# Altium project host to host.PrjPcb
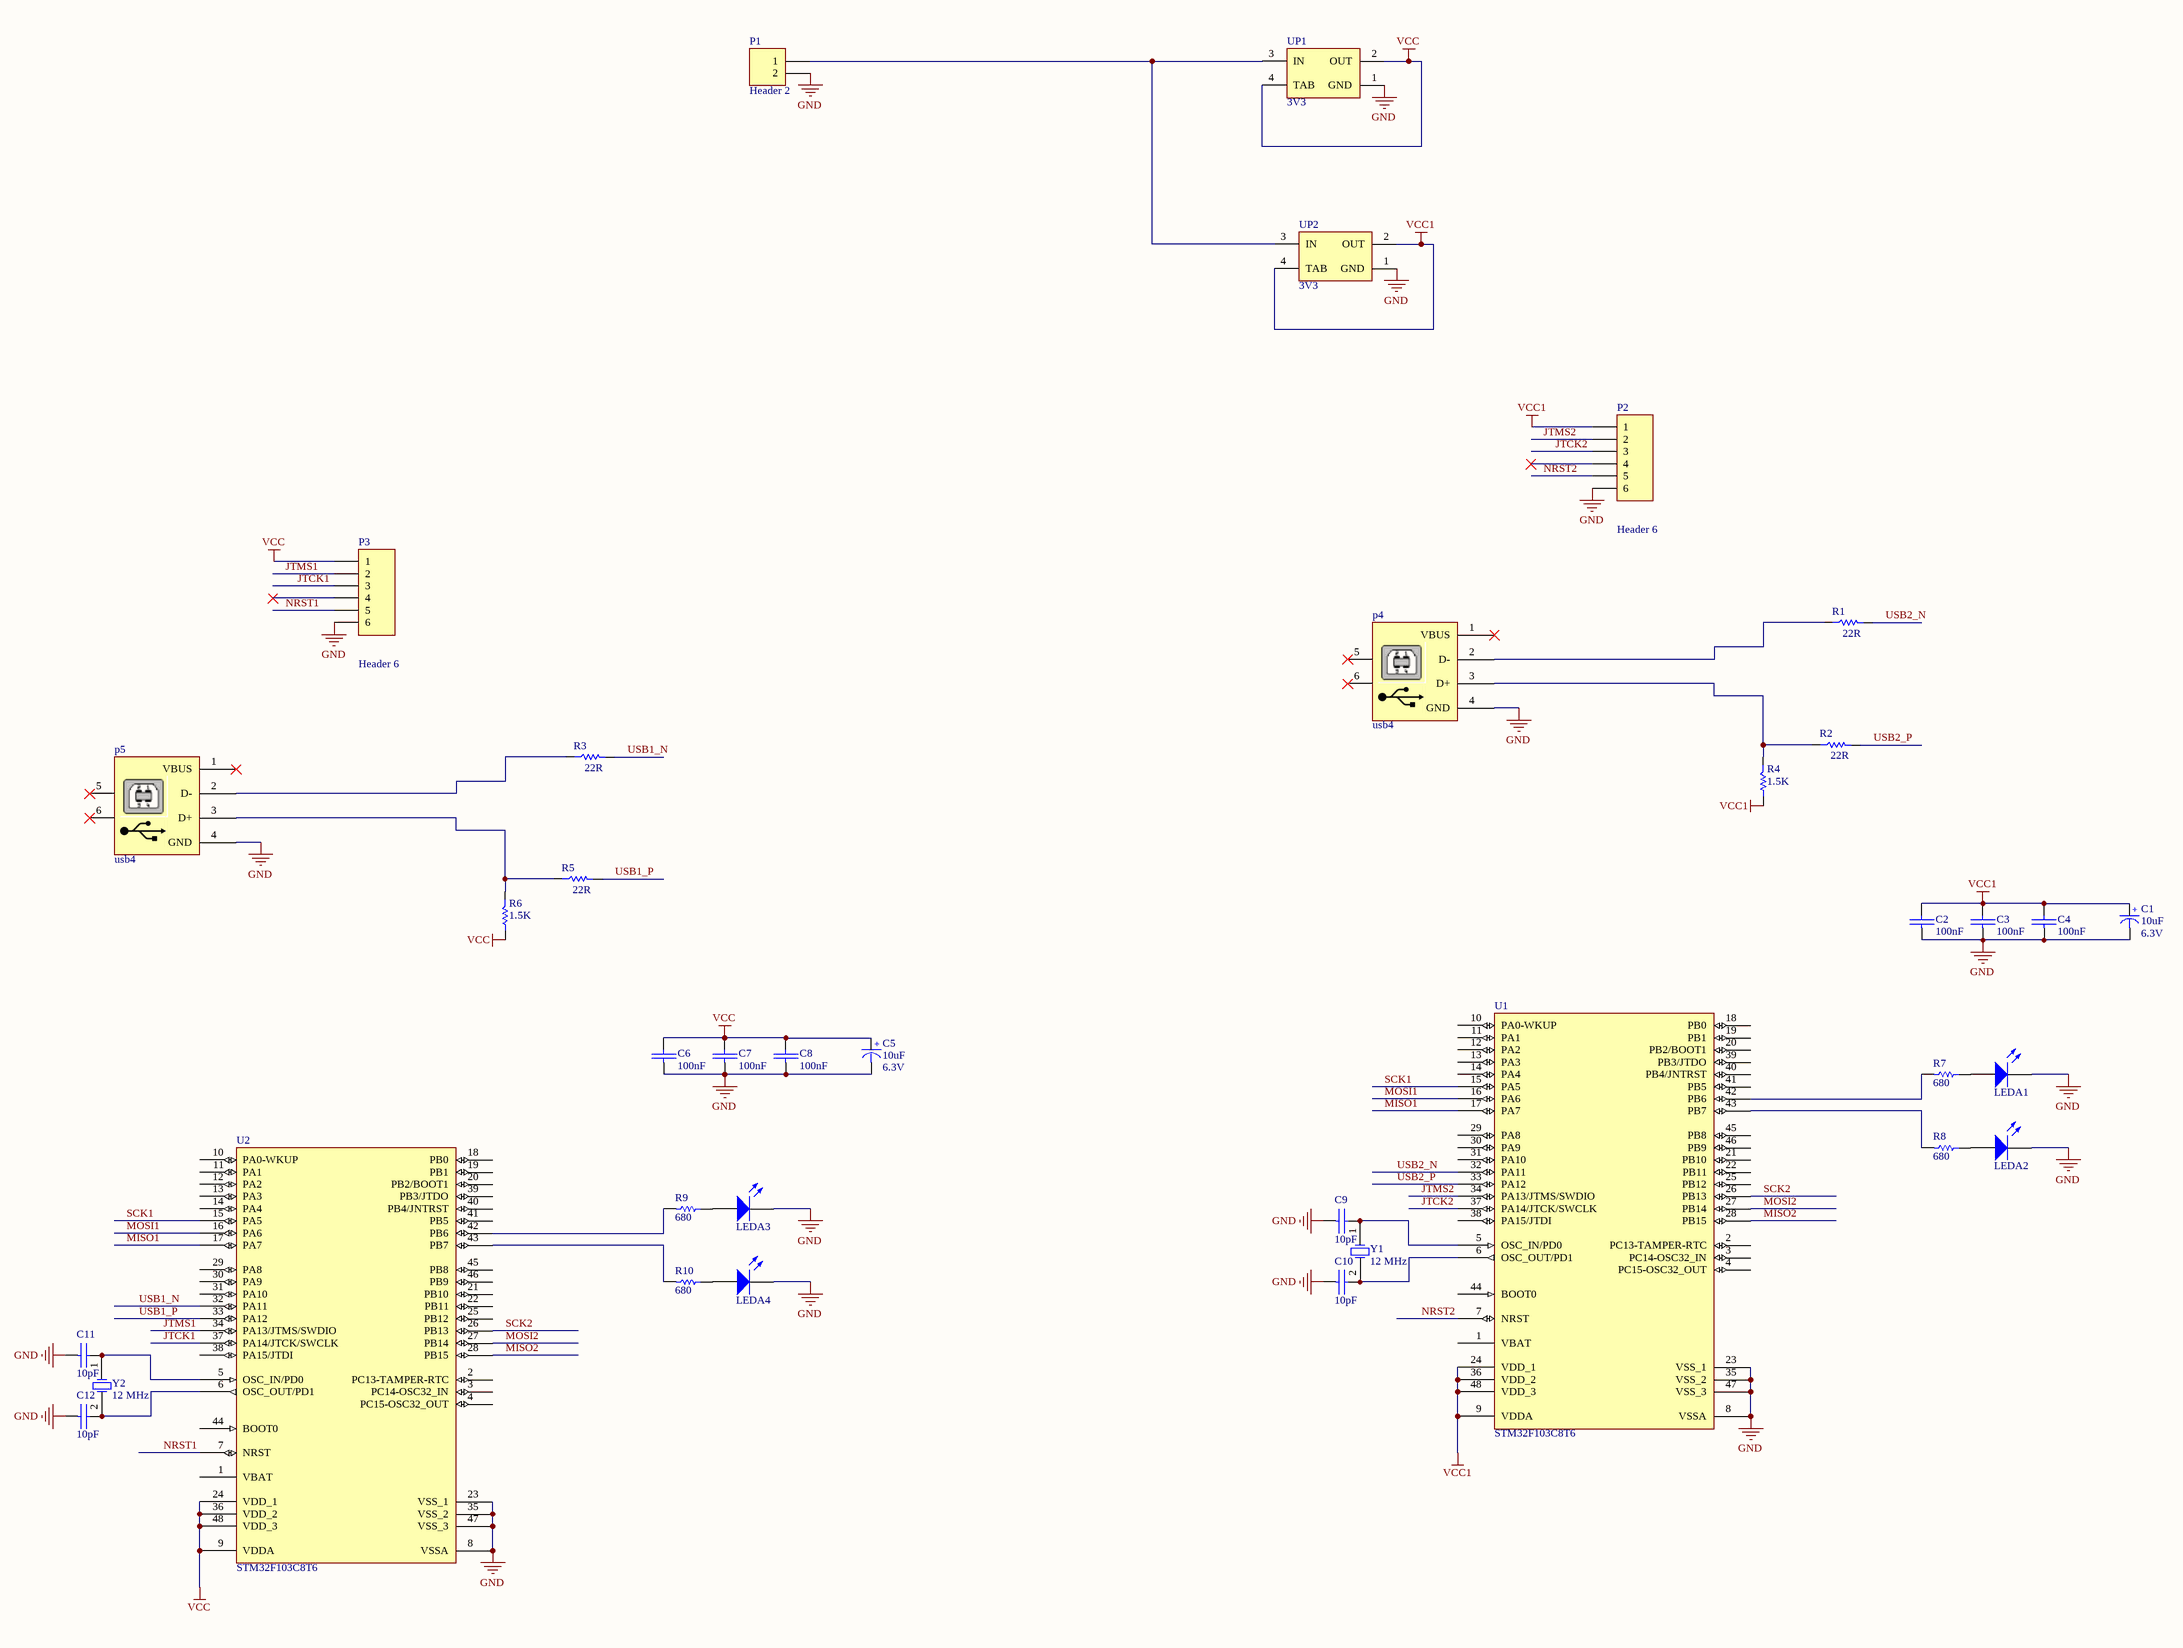
[diagram p0: Sheet1.SchDoc]
1 sheet, 37 parts. Net scope: global (net labels, ports and power ports of the same name join across sheets).
Board file: PCB1.PcbDoc

## Sheet Sheet1.SchDoc
size C; SheetNumber: 1; SheetTotal: 1

### Parts
C1  Voltage: 6.3V  [cap 01]  (hidden comment: 10uF)
C2  100nF  [SMD_CAP_1206]
C3  100nF  [SMD_CAP_1206]
C4  100nF  [SMD_CAP_1206]
C5  Voltage: 6.3V  [cap 01]  (hidden comment: 10uF)
C6  100nF  [SMD_CAP_1206]
C7  100nF  [SMD_CAP_1206]
C8  100nF  [SMD_CAP_1206]
C9  10pF  [SMD_CAP_1206]
C10  10pF  [SMD_CAP_1206]
C11  10pF  [SMD_CAP_1206]
C12  10pF  [SMD_CAP_1206]
LEDA1  LED0  [SMD_08_05_LED]  (value not drawn)
LEDA2  LED0  [SMD_08_05_LED]  (value not drawn)
LEDA3  LED0  [SMD_08_05_LED]  (value not drawn)
LEDA4  LED0  [SMD_08_05_LED]  (value not drawn)
P1  Header 2  [TMS2-M/R]
P2  Header 6  [HEADER 6X1]
P3  Header 6  [HEADER 6X1]
p4  usb4  [ConUSB_B_F]
p5  usb4  [ConUSB_B_F]
R1  22R  [SMD_RES_1206]
R2  22R  [SMD_RES_1206]
R3  22R  [SMD_RES_1206]
R4  1.5K  [SMD_RES_1206]
R5  22R  [SMD_RES_1206]
R6  1.5K  [SMD_RES_1206]
R7  680  [SMD_RES_1206]
R8  680  [SMD_RES_1206]
R9  680  [SMD_RES_1206]
R10  680  [SMD_RES_1206]
U1  STM32F103C8T6  [LQFP48_N]
U2  STM32F103C8T6  [LQFP48_N]
UP1  3V3  [SOT223]
UP2  3V3  [SOT223]
Y1  12 MHz  [XTAL]
Y2  12 MHz  [XTAL]

### Nets
GND: C1.2(-) C2.2(-) C3.2(-) C4.2(-) C5.2(-) C6.2(-) C7.2(-) C8.2(-) C9.2(-) C10.2(-) C11.2(-) C12.2(-) LEDA1.2(K) LEDA2.2(K) LEDA3.2(K) LEDA4.2(K) P1.2 P2.6 P3.6 p4.4(GND) p5.4(GND) U1.8(VSSA) U1.23(VSS_1) U1.35(VSS_2) U1.47(VSS_3) U2.8(VSSA) U2.23(VSS_1) U2.35(VSS_2) U2.47(VSS_3) UP1.1(GND) UP2.1(GND)
VCC: C5.1(+) C6.1(+) C7.1(+) C8.1(+) P3.1 R6.2 U2.9(VDDA) U2.24(VDD_1) U2.36(VDD_2) U2.48(VDD_3) UP1.2(OUT) UP1.4(TAB)
VCC1: C1.1(+) C2.1(+) C3.1(+) C4.1(+) P2.1 R4.2 U1.9(VDDA) U1.24(VDD_1) U1.36(VDD_2) U1.48(VDD_3) UP2.2(OUT) UP2.4(TAB)
JTCK1: P3.3 U2.37(PA14/JTCK/SWCLK)
JTCK2: P2.3 U1.37(PA14/JTCK/SWCLK)
JTMS1: P3.2 U2.34(PA13/JTMS/SWDIO)
JTMS2: P2.2 U1.34(PA13/JTMS/SWDIO)
MISO1: U1.17(PA7) U2.17(PA7)
MISO2: U1.28(PB15) U2.28(PB15)
MOSI1: U1.16(PA6) U2.16(PA6)
MOSI2: U1.27(PB14) U2.27(PB14)
NRST1: P3.5 U2.7(NRST)
NRST2: P2.5 U1.7(NRST)
SCK1: U1.15(PA5) U2.15(PA5)
SCK2: U1.26(PB13) U2.26(PB13)
USB1_N: R3.2 U2.32(PA11)
USB1_P: R5.2 U2.33(PA12)
USB2_N: R1.2 U1.32(PA11)
USB2_P: R2.2 U1.33(PA12)
NetC9_1: C9.1(+) U1.5(OSC_IN/PD0) Y1.1(OSC1)
NetC10_1: C10.1(+) U1.6(OSC_OUT/PD1) Y1.2(OSC2)
NetC11_1: C11.1(+) U2.5(OSC_IN/PD0) Y2.1(OSC1)
NetC12_1: C12.1(+) U2.6(OSC_OUT/PD1) Y2.2(OSC2)
NetLEDA1_1: LEDA1.1(A) R7.1
NetLEDA2_1: LEDA2.1(A) R8.1
NetLEDA3_1: LEDA3.1(A) R9.1
NetLEDA4_1: LEDA4.1(A) R10.1
NetP1_1: P1.1 UP1.3(IN) UP2.3(IN)
Netp4_2: p4.2(D-) R1.1
Netp4_3: p4.3(D+) R2.1 R4.1
Netp5_2: p5.2(D-) R3.1
Netp5_3: p5.3(D+) R5.1 R6.1
NetR7_2: R7.2 U1.42(PB6)
NetR8_2: R8.2 U1.43(PB7)
NetR9_2: R9.2 U2.42(PB6)
NetR10_2: R10.2 U2.43(PB7)

Not connected (* = marked no-connect by the designer): P2 4*; P3 4*; p4 1(VBUS)* 5* 6*; p5 1(VBUS)* 5* 6*; U1 1(VBAT) 2(PC13-TAMPER-RTC) 3(PC14-OSC32_IN) 4(PC15-OSC32_OUT) 10(PA0-WKUP) 11(PA1) 12(PA2) 13(PA3) 14(PA4) 18(PB0) 19(PB1) 20(PB2/BOOT1) 21(PB10) 22(PB11) 25(PB12) 29(PA8) 30(PA9) 31(PA10) 38(PA15/JTDI) 39(PB3/JTDO) 40(PB4/JNTRST) 41(PB5) 44(BOOT0) 45(PB8) 46(PB9); U2 1(VBAT) 2(PC13-TAMPER-RTC) 3(PC14-OSC32_IN) 4(PC15-OSC32_OUT) 10(PA0-WKUP) 11(PA1) 12(PA2) 13(PA3) 14(PA4) 18(PB0) 19(PB1) 20(PB2/BOOT1) 21(PB10) 22(PB11) 25(PB12) 29(PA8) 30(PA9) 31(PA10) 38(PA15/JTDI) 39(PB3/JTDO) 40(PB4/JNTRST) 41(PB5) 44(BOOT0) 45(PB8) 46(PB9)

### Library data of the parts
C1 C5 = Cap-Polar: Polar Capacitor; Designer: Saeid Jorablo; Organazation: ControTec; Adding Date: 1387/12/20; Value: 10uF
C2-C4 C6-C12 = Cap-Bipolar: Bipolar Capacitor; Voltage: 100V; Designer: Saeid Jorablo; Organazation: ControTec; Adding Date: 1387/12/20
  C2-C4 C6-C8: Value: 100nF
  C9-C12: Value: 10pF
LEDA1-LEDA4 = LED0: Typical INFRARED GaAs LED; Published: 8-Jun-2000; LatestRevisionDate: 08-Jul-2005; LatestRevisionNote: Mech Layer 1 removed.; PackageReference: LED-0; Publisher: Altium Limited
P1 = Header 2: Header, 2-Pin; LatestRevisionDate: 17-Jul-2002; LatestRevisionNote: Re-released for DXP Platform.; Publisher: Altium Limited
P2 P3 = Header 6: Header, 6-Pin; LatestRevisionDate: 17-Jul-2002; LatestRevisionNote: Re-released for DXP Platform.; Publisher: Altium Limited
p4 p5 = USB: USB Connector-B Type; Designer: Eng. Saeid Jorablo; Company: DASE Co; Adding Date: 10/26/2010
R1-R6 = Resistor: Value: 1K; Tolerance: 5%; Power: 1/8 W
R7-R10 = Res1: Resistor; Published: 8-Jun-2000; LatestRevisionDate: 17-Jul-2002; LatestRevisionNote: Re-released for DXP Platform.; PackageReference: AXIAL-0.3; Publisher: Altium Limited; PackageDescription: Axial Device, Thru-Hole; 2 Leads; 0.3 in Pin Spacing; Value: 680
U1 U2 = STM32F103C8T6: STM32 ARM-based 32-bit MCU with 64 Kbytes Flash, 48-pin LQFP, Industrial Temperature; Published: 30-May-2008; DatasheetVersion: rev6, Mar-2008; PackageVersion: Mar-2008; PackageReference: LQFP48; Publisher: Altium Limited; PackageDescription: 48-Pin Low-Profile Quad Flat Pack, 7 x 7 mm Body, 0.5 mm Pitch (LQFP48); ComponentLink1Description: Manufacturer Link; ComponentLink1URL: www.st.com/stm32; ComponentLink2Description: Datasheet; ComponentLink2URL: http://www.st.com/stonline/products/literature/ds/13587.pdf
UP1 UP2 = AMS1117-x.x: x.x Volt, 800mA Low-Dropout Linear Regulator, 4-pin SOT-223; Designer: Ali Hafizi; Data: 16-12-2016
Y1 Y2 = XTAL: XTAL Crystal; Company: E.P.I.L; Design Date: 11/04/2011; Value: 12 MHz